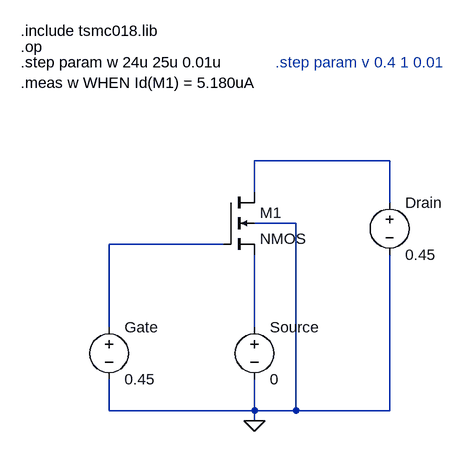
[diagram p0: schematic nmosAspRat.asc]
nmosAspRat.asc, the LTspice schematic file:
Version 4
SHEET 1 880 708
WIRE 448 288 240 288
WIRE 240 336 240 288
WIRE 448 352 448 288
WIRE 304 384 240 384
WIRE 192 416 16 416
WIRE 16 544 16 416
WIRE 240 544 240 432
WIRE 16 672 16 624
WIRE 240 672 240 624
WIRE 240 672 16 672
WIRE 304 672 304 384
WIRE 304 672 240 672
WIRE 448 672 448 432
WIRE 448 672 304 672
WIRE 240 688 240 672
FLAG 240 688 0
SYMBOL cmosn 192 336 R0
SYMATTR InstName M1
SYMATTR Value2 l=0.350u w={w}
SYMATTR Value NMOS
SYMBOL voltage 448 336 R0
WINDOW 123 0 0 Left 0
WINDOW 39 0 0 Left 0
SYMATTR InstName Drain
SYMATTR Value 0.45
SYMBOL voltage 240 528 R0
WINDOW 123 0 0 Left 0
WINDOW 39 0 0 Left 0
SYMATTR InstName Source
SYMATTR Value 0
SYMBOL voltage 16 528 R0
WINDOW 123 0 0 Left 0
WINDOW 39 0 0 Left 0
SYMATTR InstName Gate
SYMATTR Value 0.45
TEXT -120 88 Left 2 !.include tsmc018.lib
TEXT -120 112 Left 2 !.op
TEXT -120 136 Left 2 !.step param w 24u 25u 0.01u
TEXT -120 168 Left 2 !.meas w WHEN Id(M1) = 5.180uA
TEXT 272 136 Left 2 ;.step param v 0.4 1 0.01

The netlist it stands for:
* nmosAspRat.asc
M1 N001 N002 N003 0 NMOS l=0.350u w={w}
V§Drain N001 0 0.45
V§Source N003 0 0
V§Gate N002 0 0.45
.model NMOS NMOS
.model PMOS PMOS
.lib standard.mos
.include tsmc018.lib
.op
.step param w 24u 25u 0.01u
.meas w WHEN Id(M1) = 5.180uA
* .step param v 0.4 1 0.01
.backanno
.end